# EAGLE design HB-UNI-Sen-PM_SHT31_Board_v2 (EAGLE 8.7.1)
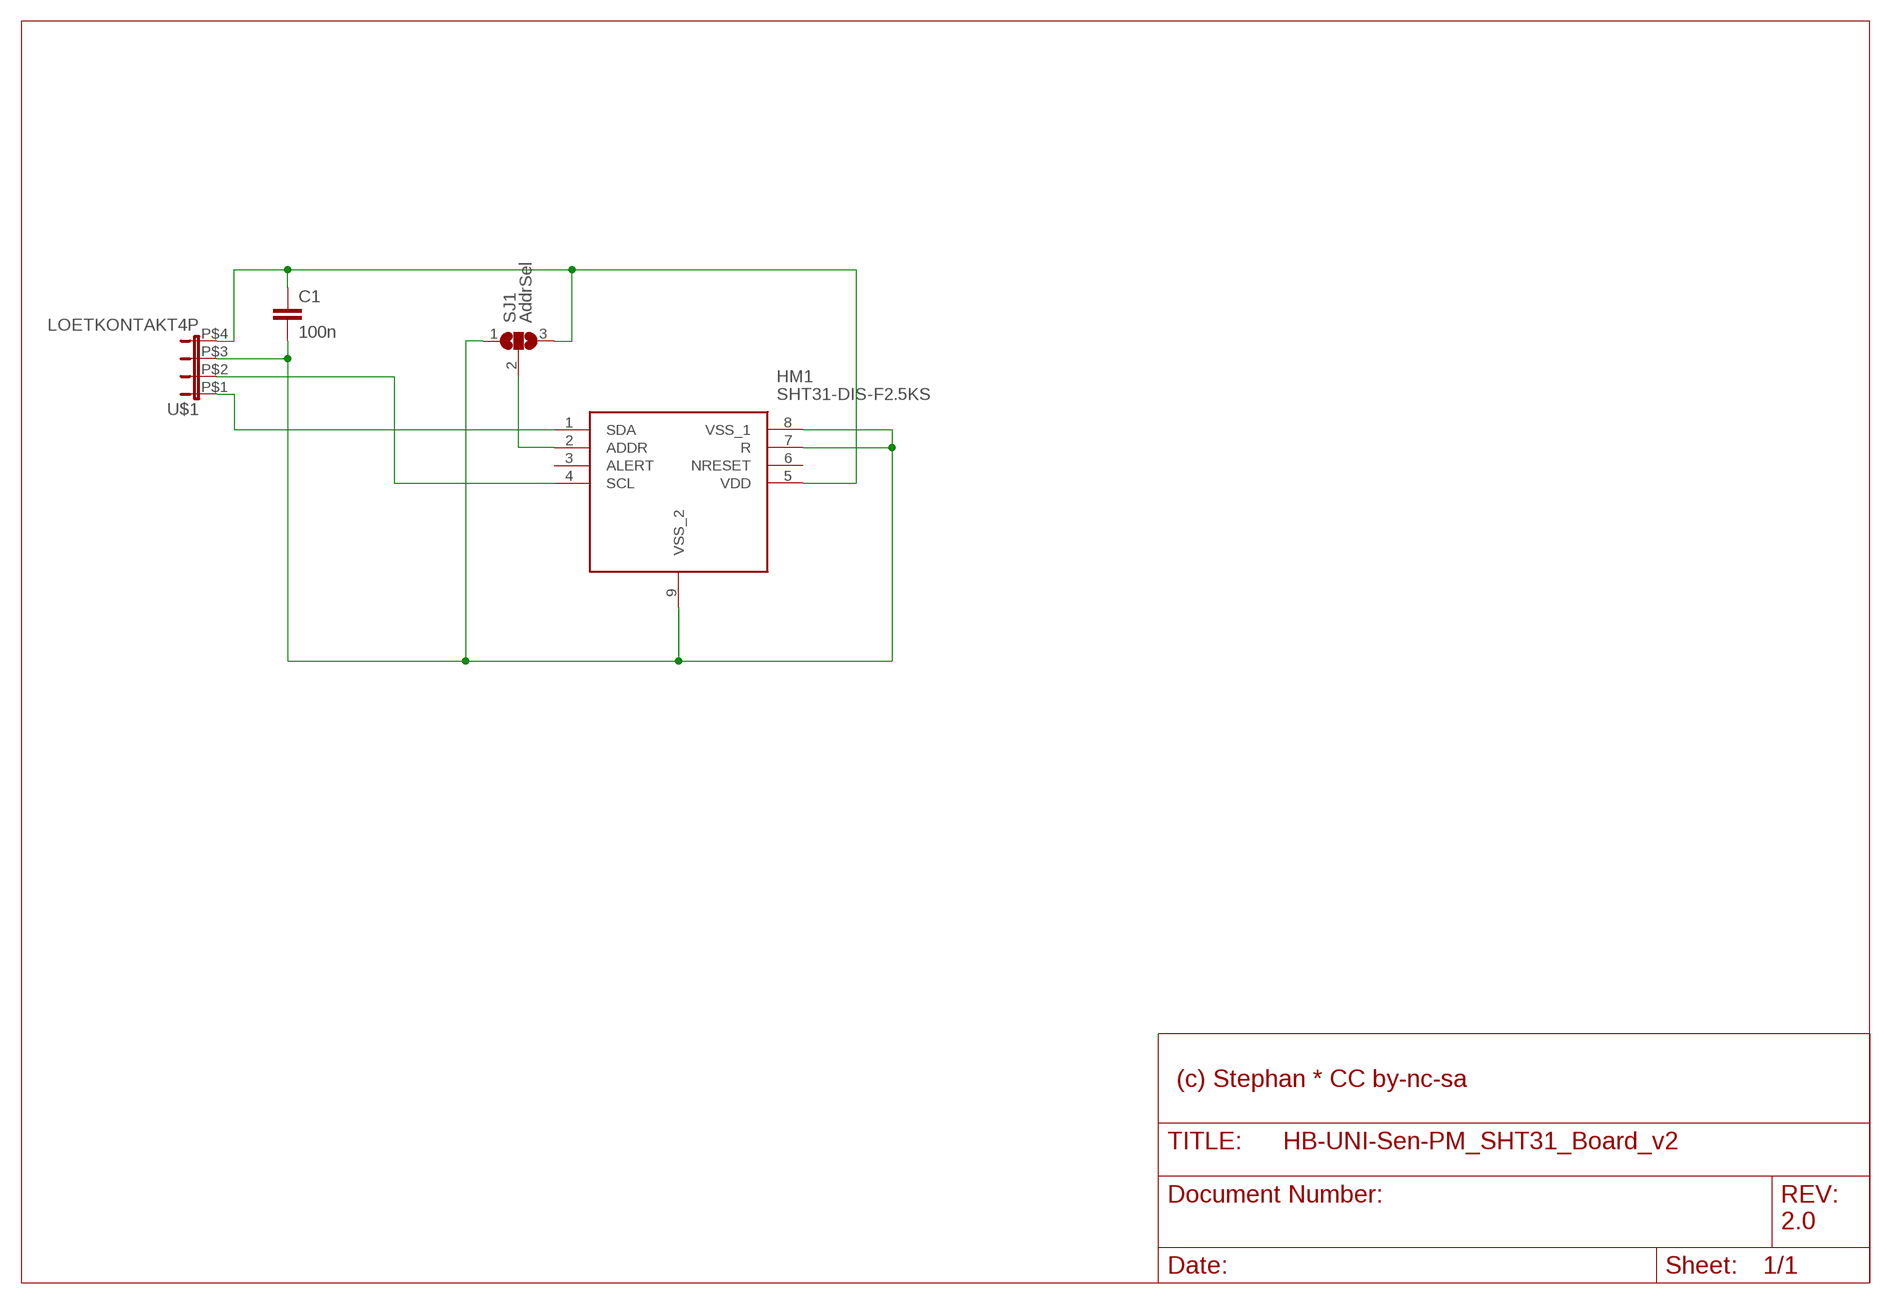
[diagram p0: schematic, sheet 1]

## Parts
C1  100n  C-EUC0603K  [C0603K]
HM1  SHT31-DIS-F2.5KS  [SON50P250X250X90-9N]
SJ1  AddrSel  SJ2W  [SJ_2]
U$1  LOETKONTAKT4P  [LOETKONTAKT4P]

## Nets
3V3: C1.1 HM1.5(VDD) SJ1.3 U$1.P$4
ADDR: HM1.2(ADDR) SJ1.2
GND: C1.2 HM1.7(R) HM1.8(VSS_1) HM1.9(VSS_2) SJ1.1 U$1.P$3
SCL: HM1.4(SCL) U$1.P$2
SDA: HM1.1(SDA) U$1.P$1
Unconnected: HM1.3(ALERT) HM1.6(NRESET)

## Notes on the sheet
- (c) Stephan * CC by-nc-sa
- 2.0

## Library data of the parts
C1 = rcl:C-EU: CAPACITOR, European symbol
HM1 = SamacSys_Parts:SHT31-DIS-F2.5KS: Board Mount Humidity Sensors SHT3x Humidity and Temperature Sensor Source: Datasheet <https://componentsearchengine.com/Datasheets/1/SHT31-DIS-F2.5kS.pdf>; ARROW_PART_NUMBER: SHT31-DIS-F2.5KS; ARROW_PRICE-STOCK: https://www.arrow.com/en/products/sht31-dis-f2.5ks/sensirion-ag; DESCRIPTION: Board Mount Humidity Sensors SHT3x Humidity and Temperature Sensor; HEIGHT: 0.9mm; MANUFACTURER_NAME: Sensirion; MANUFACTURER_PART_NUMBER: SHT31-DIS-F2.5kS; MOUSER_PART_NUMBER: 403-SHT31-DIS-F; MOUSER_PRICE-STOCK: https://www.mouser.co.uk/ProductDetail/Sensirion/SHT31-DIS-F25kS?qs=SiS427jF8nOsxbyIRpupXg%3D%3D
SJ1 = jumper:SJ2W: SMD solder JUMPER
U$1 = StephansLib:LOETKONTAKT4P: Loetkontakt zur senkrechten Platinenverbindung 4polig

## Board
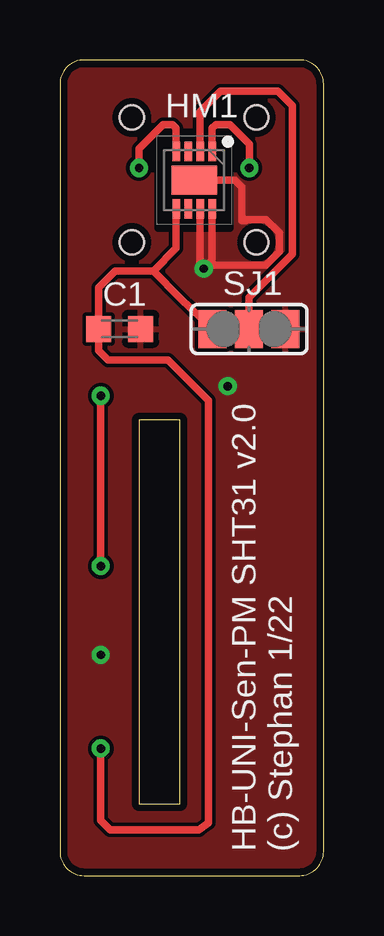
[diagram p1: board, top side]
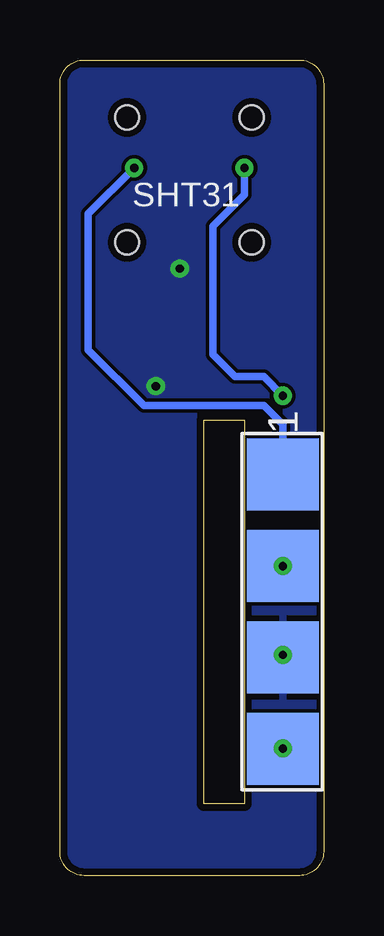
[diagram p2: board, bottom side, seen from below]

Size 11 x 34 mm. Coordinates in mm from the lower left corner, seen from the top.
Outline: 0,33 0,1 arc90 1,0 10,0 arc90 11,1 11,33 arc90 10,34 1,34 arc90 0,33
Outline: 3.3,19 3.3,3 5,3 5,19 3.3,19
Copper layers (1*16): Top 0.035mm / dielectric 1.5mm / Bottom 0.035mm
Design rules "DRC23Jun21": minimum track width 6mil, minimum drill 0.35mm, track to track 6mil, track to pad 6mil, pad to pad 6mil, via to via 6mil, smd to smd 6mil, copper to edge 0.3mm, drill to drill 6mil, minimum pad ring 10mil, minimum via ring 8mil, stop-mask expansion 4mil, vias tented up to drill 0.4mm, thermal gap 10mil
Holes 1 mm at 3,31.6 8.2,31.6 8.2,26.4 3,26.4
tRestrict: area 4.1,27 to 7.1,31

### Footprints (pad centres in the part's own frame; a part is rotated, then mirrored left to right if it is on the bottom)
C0603K = smd 1.05 x 1.08: 1 -0.875,0; 2 0.875,0
SON50P250X250X90-9N = smd 0.8 x 0.3: 1 -1.2,0.75; 2 -1.2,0.25; 3 -1.2,-0.25; 4 -1.2,-0.75; 5 1.2,-0.75; 6 1.2,-0.25; 7 1.2,0.25; 8 1.2,0.75 | smd 1.2 x 1.9: 9 0,0
SJ_2 = smd 1.168 x 1.6: 1 -1.524,0; 2 0,0; 3 1.524,0
LOETKONTAKT4P = smd 3 x 3: P$1 -5.715,0; P$2 -1.905,0; P$3 1.905,0; P$4 5.715,0

### Placement (x,y rotation side)
C1  2.49,22.79 0 top
HM1  5.6,28.99 270 top
SJ1  7.89,22.78 180 top
U$1  1.7,11 270 bottom

### Tracks (layer width: path | path; a pad name or v marks a point on that pad's centre or on a via)
3V3  (via drill 0.35)
  Top 0.305: HM1.5 4.85,26.15 3.9,25.2 | 3.9,25.2 2.3,25.2 1.61,24.52 C1.1 1.61,21.89 2,21.5 4.5,21.5 6.21,19.8 6.21,2.21 5.8,1.9 2.1,1.9 1.7,2.3 v1.7,5.3 | 3.9,25.2 5.02,24.08 SJ1.3
  Bottom 0.305: U$1.P$4 v1.7,5.3
ADDR
  Top 0.305: HM1.2 5.85,31.85 6.7,32.7 9.1,32.7 9.7,32.1 9.7,25.9 7.89,24.09 SJ1.2
GND  (via drill 0.35)
  Top 0.305: HM1.7 5.85,25.45 v6,25.3 | HM1.8 6.35,25.65 v6,25.3 | HM1.9 7.31,28.99 7.6,28.7 7.6,27.3 7.75,27.3 7.81,27.35 8.6,27.35 9.15,26.79 9.15,26.01 8.6,25.45 6.15,25.45 v6,25.3
  other vias: 1.7,9.2 7,20.4
  pour Top: 0,0.1 -0.1,34 11.1,33.9 10.9,-0.1
  pour Bottom: -0.4,34.2 11.3,34.2 11.4,-0.2 -0.3,-0.2
SCL  (via drill 0.35)
  Top 0.305: HM1.4 4.85,31.15 4.7,31.3 4.3,31.3 3.3,30.3 v3.3,29.5 | v1.7,20 U$1.P$2
  Bottom 0.305: v3.3,29.5 3.3,28.39 4.62,27.07 4.62,21.72 3.7,20.8 2.5,20.8 v1.7,20 | U$1.P$2
  other vias: 1.7,12.9
SDA  (via drill 0.35)
  Top 0.305: HM1.1 6.35,31.15 6.5,31.3 7.1,31.3 7.9,30.5 v7.9,29.5
  Bottom 0.305: v7.9,29.5 9.82,27.58 9.82,21.92 7.5,19.6 2.5,19.6 1.7,18.8 U$1.P$1

### Text on the board
tNames: HB-UNI-Sen-PM SHT31 v2.0 / (c) Stephan 1/22
bNames: SHT31